# Altium schematic sheet [07] - CSI-DSI & RTC.SchDoc: CSI-DSI & RTC
size A3; DrawnBy: Farogh; Organization: Farogh Iftekhar; Address1: Defence Coloney; Address2: New Delhi; Revision: V1I0; SheetNumber: 7
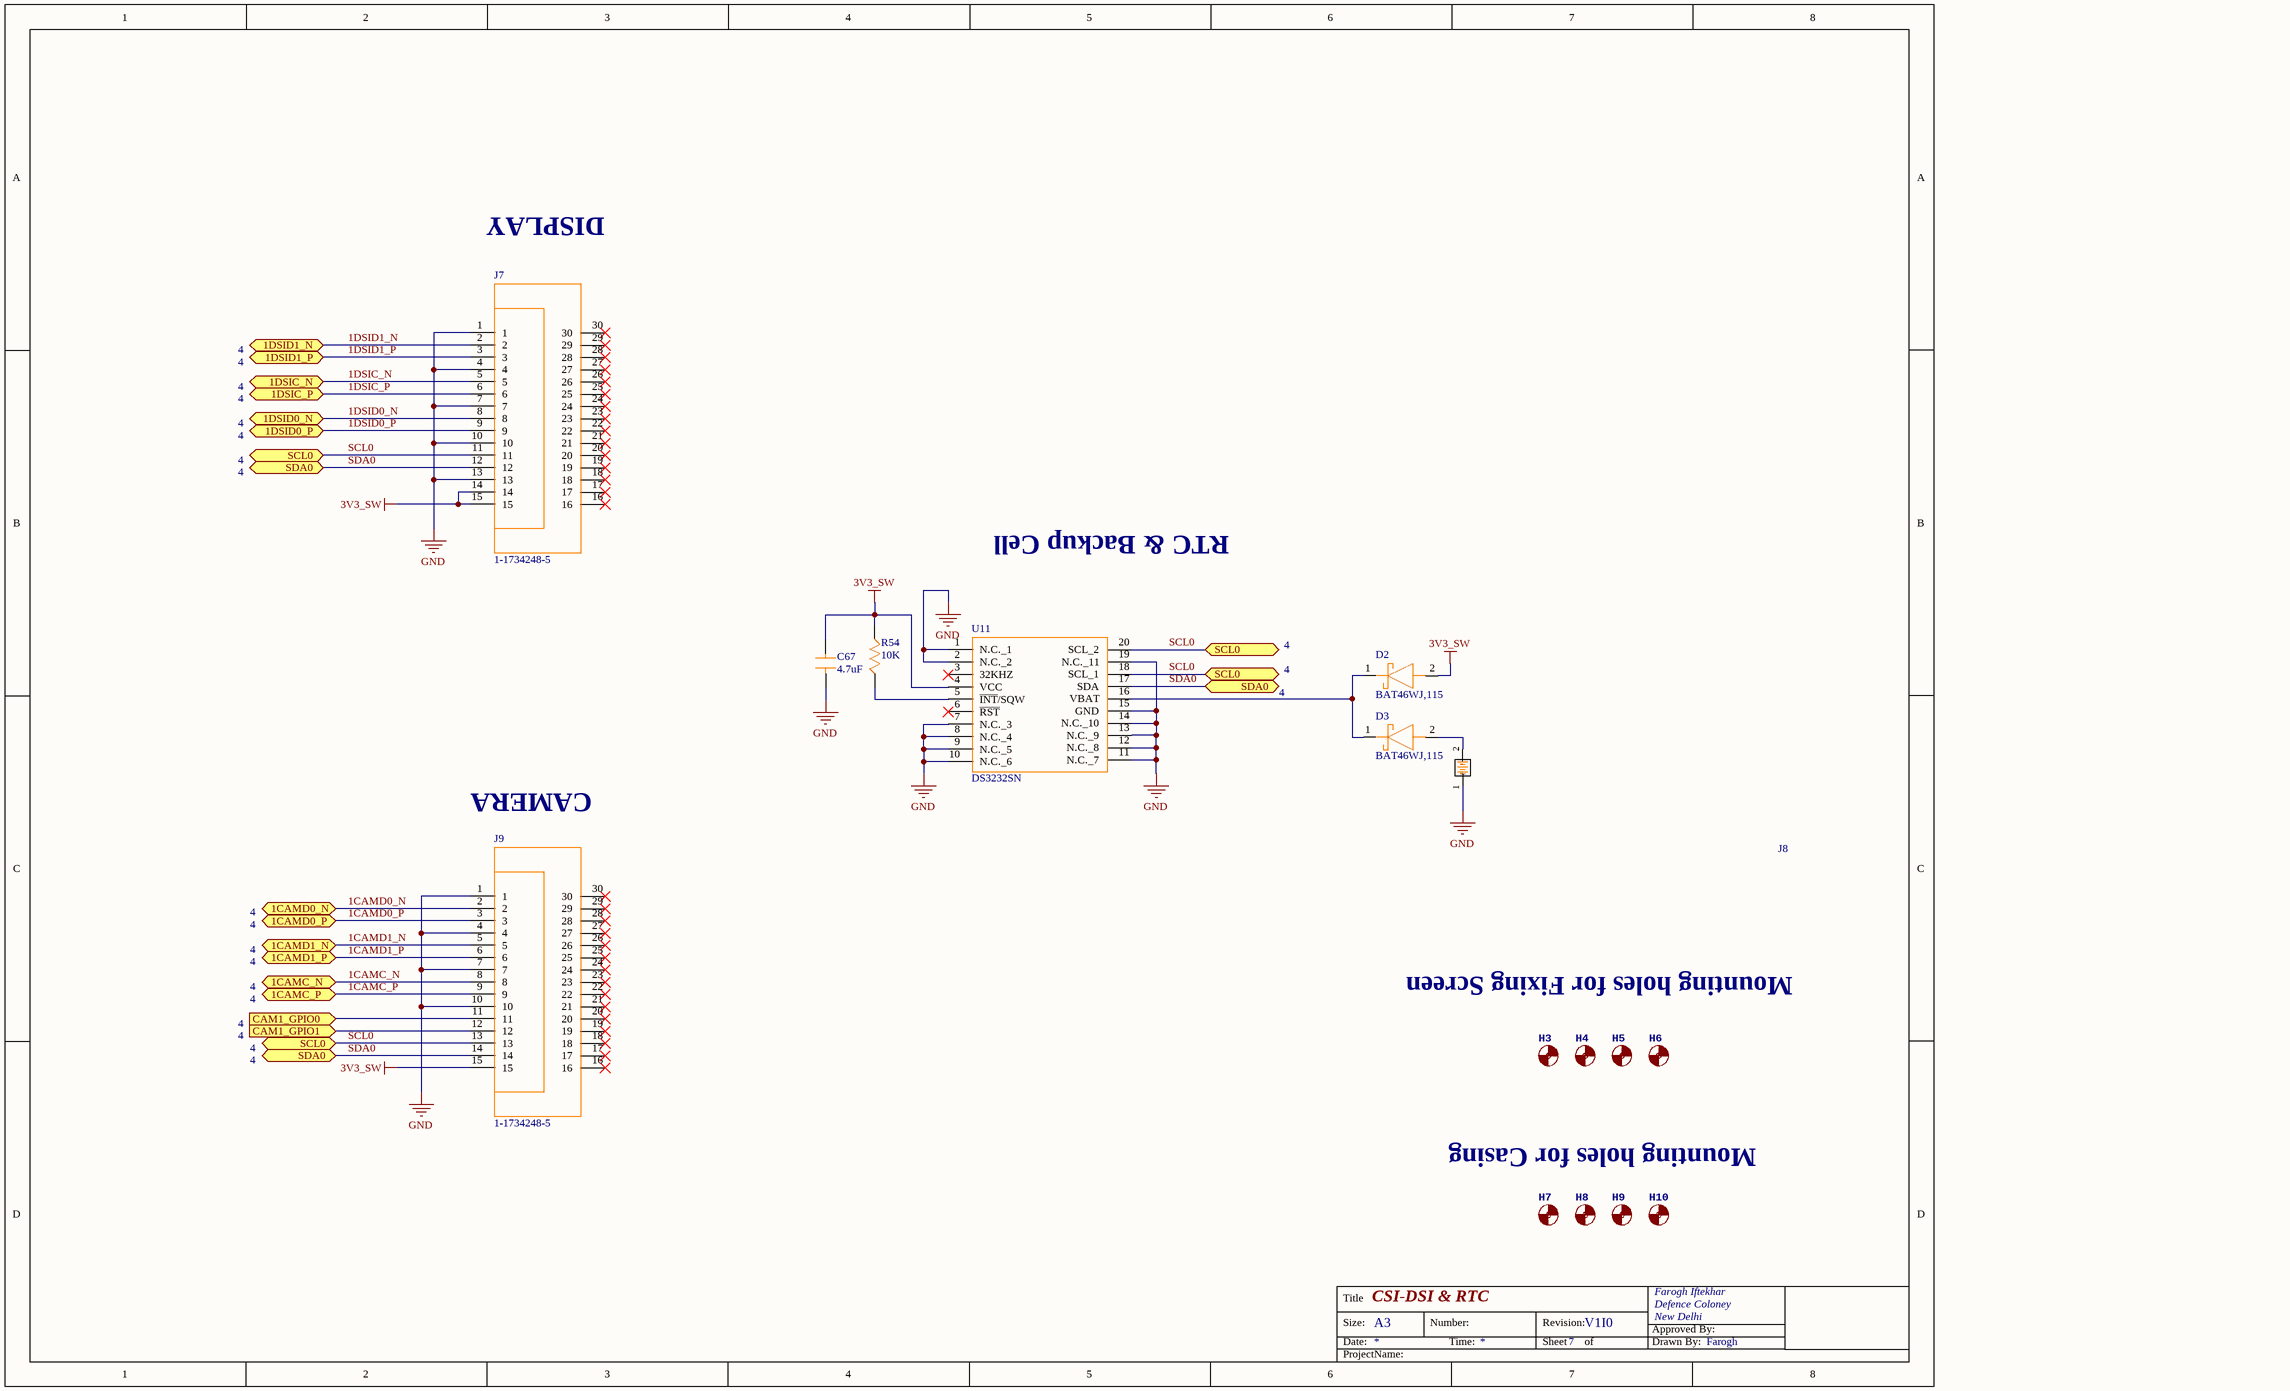
[diagram p0: [07] - CSI-DSI & RTC.SchDoc]

## Parts
C67  4.7uF  [C0805]
D2  BAT46WJ,115  [BAT46WJ,115]
D3  BAT46WJ,115  [BAT46WJ,115]
H3  MOUNTING HOLE with drill center marker  [3,0]  (value not drawn)
H4  MOUNTING HOLE with drill center marker  [3,0]  (value not drawn)
H5  MOUNTING HOLE with drill center marker  [3,0]  (value not drawn)
H6  MOUNTING HOLE with drill center marker  [3,0]  (value not drawn)
H7  MOUNTING HOLE with drill center marker  [3,0]  (value not drawn)
H8  MOUNTING HOLE with drill center marker  [3,0]  (value not drawn)
H9  MOUNTING HOLE with drill center marker  [3,0]  (value not drawn)
H10  MOUNTING HOLE with drill center marker  [3,0]  (value not drawn)
J7  1-1734248-5  [1-1734248-5]
J8  PRT-00783_F  [PRT-00783_F]  (value not drawn)
J9  1-1734248-5  [1-1734248-5]
R54  10K  [R0805]
U11  DS3232SN  [DS3232SN]

## Ports
1CAMC_N (bidir, see 4), 1CAMC_P (bidir, see 4), 1CAMD0_N (bidir, see 4), 1CAMD0_P (bidir, see 4), 1CAMD1_N (bidir, see 4), 1CAMD1_P (bidir, see 4), 1DSIC_N (bidir, see 4), 1DSIC_P (bidir, see 4), 1DSID0_N (bidir, see 4), 1DSID0_P (bidir, see 4), 1DSID1_N (bidir, see 4), 1DSID1_P (bidir, see 4), CAM1_GPIO0 (in, see 4), CAM1_GPIO1 (in, see 4), SCL0 (bidir, see 4), SDA0 (see 4)

## Nets
3V3_SW: C67.2 D2.2(A) J7.14 J7.15 J9.15 R54.2 U11.4(VCC)
GND: C67.1 J7.1 J7.4 J7.7 J7.10 J7.13 J8.1(-) J9.1 J9.4 J9.7 J9.10 U11.1(N.C._1) U11.2(N.C._2) U11.7(N.C._3) U11.8(N.C._4) U11.9(N.C._5) U11.10(N.C._6) U11.11(N.C._7) U11.12(N.C._8) U11.13(N.C._9) U11.14(N.C._10) U11.15(GND) U11.19(N.C._11)
1CAMC_N: J9.8 ; port 1CAMC_N
1CAMC_P: J9.9 ; port 1CAMC_P
1CAMD0_N: J9.2 ; port 1CAMD0_N
1CAMD0_P: J9.3 ; port 1CAMD0_P
1CAMD1_N: J9.5 ; port 1CAMD1_N
1CAMD1_P: J9.6 ; port 1CAMD1_P
1DSIC_N: J7.5 ; port 1DSIC_N
1DSIC_P: J7.6 ; port 1DSIC_P
1DSID0_N: J7.8 ; port 1DSID0_N
1DSID0_P: J7.9 ; port 1DSID0_P
1DSID1_N: J7.2 ; port 1DSID1_N
1DSID1_P: J7.3 ; port 1DSID1_P
CAM1_GPIO0: J9.11 ; port CAM1_GPIO0
CAM1_GPIO1: J9.12 ; port CAM1_GPIO1
SCL0: J7.11 J9.13 U11.18(SCL_1) U11.20(SCL_2) ; port SCL0
SDA0: J7.12 J9.14 U11.17(SDA) ; port SDA0
NetD2_1: D2.1(K) D3.1(K) U11.16(VBAT)
NetD3_2: D3.2(A) J8.2(+)
NetR54_1: R54.1 U11.5(~{INT}/SQW)

Not connected (* = marked no-connect by the designer): J7 16* 17* 18* 19* 20* 21* 22* 23* 24* 25* 26* 27* 28* 29* 30*; J9 16* 17* 18* 19* 20* 21* 22* 23* 24* 25* 26* 27* 28* 29* 30*; U11 3(32KHZ)* 6(~{RST})*

## Notes on the sheet
- DISPLAY
- RTC & Backup Cell
- CAMERA
- Mounting holes for Fixing Screen
- Mounting holes for Casing
- Title
- Size:
- Date:
- A3
- Number:
- Time:
- Revision:
- Sheet
- of
- Approved By:
- Drawn By:
- ProjectName:

## Library data of the parts
C67 = C_0805-4.7uF: Multilayer Ceramic Capacitors MLCC - SMD/SMT FACTORY NOT ACCEPTING ORDERS; Manufacturer: KEMET; Manufacturer Part Number: C0805X475K4RACAUTO; Tolerance: 10 %; Type: X7R Dielectric; Voltage Rating DC: 16 VDC; Capacitance - nF: 4700 nF; Class: Class 2; Dielectric: X7R; Qualification: AEC-Q200; Product Status: New Product; Supplier 1: Mouser; RoHS: RoHS Compliant; Category: Multilayer Ceramic Capacitors MLCC - SMD/SMT; Stock 1: 4312; Pricing 1: 1=0.860, 10=0.582, 100=0.363, 500=0.328, 1000=0.300, 2500=0.196, 10000=0.186, 25000=0.182, 50000=0.175 (USD); Capacitance: 4.7 uF; Height: 1.25 mm; Length: 2 mm; Package / Case: 0805 (2012 metric); Packaging: Reel; Product: Automotive MLCCs; Series: SMD Auto X7R Flex; Termination Style: SMD/SMT; Width: 1.25 mm; Brand: KEMET; Case Code - in: 0805; Case Code - mm: 2012; Maximum Operating Temperature: + 125 C; Minimum Operating Temperature: - 55 C; Product Type: Ceramic Capacitors; Standard Pack Qty: 2500; Subcategory: Capacitors; Termination: Flexible (Soft); Tradename: FT-CAP; RoHS - Mouser: Y; Minimum Order Quantity: 2500; Reeling: True; ComponentLink1URL: https://www.mouser.com/datasheet/2/212/KEM_C1078_X7R_FT-CAP_AUTO_SMD-1103315.pdf; ComponentLink1Description: https://www.mouser.com/datasheet/2/212/KEM_C1078_X7R_FT-CAP_AUTO_SMD-1103315.pdf; Supplier Part Number 1: 80-C0805X475K4RAUTO
D2 D3 = BAT46WJ,115: Schottky Diodes & Rectifiers Schottky Diodes 100V 250mA Single; Manufacturer: Nexperia; CNHTS: 8541100000; Ifsm - Forward Surge Current: 2.5 A; Ir - Reverse Current: 2 uA; MXHTS: 85411001; Pd - Power Dissipation: 400 mW; trr - Reverse Recovery time: 5.9 ns; Vf - Forward Voltage: 710 mV; Supplier 1: Mouser; Manufacturer Part Number: BAT46WJ,115; RoHS: RoHS Compliant; Category: Schottky Diodes & Rectifiers; Stock 1: 354863; Pricing 1: 1=0.370, 10=0.245, 100=0.105, 1000=0.081, 3000=0.062, 9000=0.055, 24000=0.051, 45000=0.046, 99000=0.044 (USD); Configuration: Single; Package / Case: SOD-323-2; Packaging: Cut Tape; Product: Schottky Diodes; Technology: Si; Brand: Nexperia; Mounting Style: SMD/SMT; HTS Code: 8541100070; If - Forward Current: 250 mA; Product Type: Schottky Diodes & Rectifiers; Standard Pack Qty: 3000; Subcategory: Diodes & Rectifiers; TARIC: 8541100000; Vrrm - Repetitive Reverse Voltage: 100 V; RoHS - Mouser: Y; Minimum Order Quantity: 1; Reeling: True; ComponentLink1URL: http://www.mouser.com/datasheet/2/916/BAT46WJ-1527107.pdf; ComponentLink1Description: http://www.mouser.com/datasheet/2/916/BAT46WJ-1527107.pdf; Supplier Part Number 1: 771-BAT46WJ115
H3-H10 = MOUNT-HOLE3.0
J7 J9 = CSI-1-1734248-5: FFC & FPC Connectors 15P 1.0 FPC, Zip V/T SMT; Manufacturer: TE Connectivity / AMP; Current Rating: 1 A; Gender: Female; Mounting Angle: Vertical; Number of Positions: 15 Position; Voltage Rating: 125 V; Pitch: 1 mm; Actuation Type: ZIF; Supplier 1: Mouser; Manufacturer Part Number: 1-1734248-5; RoHS: RoHS Compliant; Category: FFC & FPC Connectors; Stock 1: 4644; Pricing 1: 1=0.960, 10=0.801, 100=0.734, 500=0.600, 1000=0.534, 2000=0.483, 5000=0.477 (USD); Contact Plating: Gold; Housing Material: Polyamide (PA); Product: Board Mount; Series: FPC; Termination Style: SMD/SMT; Brand: TE Connectivity / AMP; Contact Material: Phosphor Bronze; Maximum Operating Temperature: + 85 C; Minimum Operating Temperature: - 20 C; Product Type: FFC & FPC Connectors; Standard Pack Qty: 1000; Subcategory: FFC & FPC Connectors; RoHS - Mouser: Y; Minimum Order Quantity: 1; Reeling: False; ComponentLink1URL: https://www.mouser.com/datasheet/2/418/NG_CD_1734248_E1__-658235.pdf; ComponentLink1Description: https://www.mouser.com/datasheet/2/418/NG_CD_1734248_E1__-658235.pdf
J8 = PRT-00783_F: SparkFun Accessories Coin Cell Battery Holder - 20mm (PTH); CNHTS: 8536900000; TARIC: 8536909599; Supplier 1: Mouser; Manufacturer: SparkFun; Manufacturer Part Number: PRT-00783; RoHS: RoHS Compliant; Category: SparkFun Accessories; Stock 1: 216; Pricing 1: 1=1.50 (USD); Product: Powers; Type: Coin Cell Battery Holders; Brand: SparkFun; HTS Code: 8536908585; Product Type: Accessories; Standard Pack Qty: 1; RoHS - Mouser: Y; Minimum Order Quantity: 1; Reeling: False; Supplier Part Number 1: 474-PRT-00783
R54 = R_0805-10K: Thick Film Resistors - SMD 10K   OHM   1% 1/4W; Manufacturer: Yageo; Manufacturer Part Number: RC0805FR-7W10KL; Power Rating: 125 mW, 250 mW; Resistance: 10 kOhms; Temperature Coefficient: 100 PPM / C; Voltage Rating: 150 V; CNHTS: 8533211000; MXHTS: 85332101; TARIC: 8533210000; Supplier 1: Mouser; RoHS: RoHS Compliant; Category: Thick Film Resistors - SMD; Stock 1: 8240; Pricing 1: 1=0.190, 10=0.115, 100=0.038, 1000=0.026, 5000=0.020, 10000=0.019, 25000=0.018, 100000=0.017 (USD); Application: High Reliability; Features: -; Height: 0.5 mm; Length: 2 mm; Package / Case: 0805 (2012 metric); Packaging: Cut Tape; Product: Thick Film Resistors SMD; Series: RC; Technology: Thick Film; Termination Style: SMD/SMT; Tolerance: 1 %; Type: High Power; Width: 1.25 mm; Brand: Yageo; Mounting Style: PCB Mount; Case Code - in: 0805; Case Code - mm: 2012; HTS Code: 8533210030; Maximum Operating Temperature: + 155 C; Minimum Operating Temperature: - 55 C; Product Type: Thick Film Resistors; Standard Pack Qty: 5000; Subcategory: Resistors; RoHS - Mouser: Y; Minimum Order Quantity: 1; Reeling: True; ComponentLink1URL: http://www.mouser.com/datasheet/2/447/yageo_01152019_DESIGN_KITS_8_2012-1522572.pdf; ComponentLink1Description: http://www.mouser.com/datasheet/2/447/yageo_01152019_DESIGN_KITS_8_2012-1522572.pdf; Supplier Part Number 1: 603-RC0805FR-7W10KL
U11 = DS3232SN: Real Time Clock Integrated RTC/TCXO/Crystal; Manufacturer: Maxim Integrated; Manufacturer Part Number: DS3232SN#T&R; Function: Calendar, Clock; RTC Bus Interface: Serial, I2C; RTC Memory Size: 236 B; Battery Backup Switching: Backup Switching; Supply Voltage - Max: 5.5 V; Supply Voltage - Min: 2.3 V; Supplier 1: Mouser; RoHS: RoHS Compliant By Exemption; Category: Real Time Clock; Stock 1: 2379; Pricing 1: 1=8.75, 10=7.91, 25=7.54, 50=6.89, 100=6.55, 250=6.25, 500=5.69, 1000=4.70, 2000=4.64 (USD); Package / Case: SOIC-20; Packaging: Cut Tape; Product: Real Time Clocks; Series: DS3232SN; Brand: Maxim Integrated; Mounting Style: SMD/SMT; Maximum Operating Temperature: + 85 C; Minimum Operating Temperature: - 40 C; Product Type: Real Time Clock; Standard Pack Qty: 1000; Subcategory: Clock & Timer ICs; RoHS - Mouser: E; Minimum Order Quantity: 1; Reeling: True; ComponentLink1URL: https://www.mouser.com/datasheet/2/256/DS3232-1389141.pdf; ComponentLink1Description: https://www.mouser.com/datasheet/2/256/DS3232-1389141.pdf; Supplier Part Number 1: 700-DS3232SN#T&R-